# Altium schematic sheet [4]-MCU_MEMORY.SchDoc
size A4
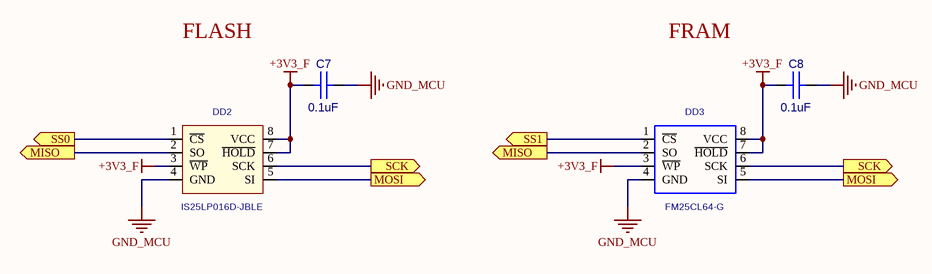
[diagram p0: [4]-MCU_MEMORY.SchDoc]

## Parts
C7  0.1uF  [CC0603]
C8  0.1uF  [CC0603]
DD2  IS25LP016D-JBLE  [EIAJ_SO8]
DD3  FM25CL64-G  [SO-8]

## Ports
MISO (out), MOSI (out), SCK (out), SS0 (out), SS1 (out)

## Nets
+3V3_F: C7.1(A) C8.1(A) DD2.3(~{WP}) DD2.7(~{HOLD}) DD2.8(VCC) DD3.3(~{WP}) DD3.7(~{HOLD}) DD3.8(VCC)
GND_MCU: C7.2(B) C8.2(B) DD2.4(GND) DD3.4(GND)
MISO: DD2.2(SO) DD3.2(SO) ; port MISO
MOSI: DD2.5(SI) DD3.5(SI) ; port MOSI
SCK: DD2.6(SCK) DD3.6(SCK) ; port SCK
SS0: DD2.1(~{CS}) ; port SS0
SS1: DD3.1(~{CS}) ; port SS1

## Notes on the sheet
- FLASH
- FRAM

## Library data of the parts
C7 C8 = CC0603: Value: 0.1uF
DD2 = S25FL016A0LMFI01: Value: IS25LP016D-JBLE
DD3 = FM25CL64-G: Value: *